# Altium schematic sheet fdc.SchDoc
size A4
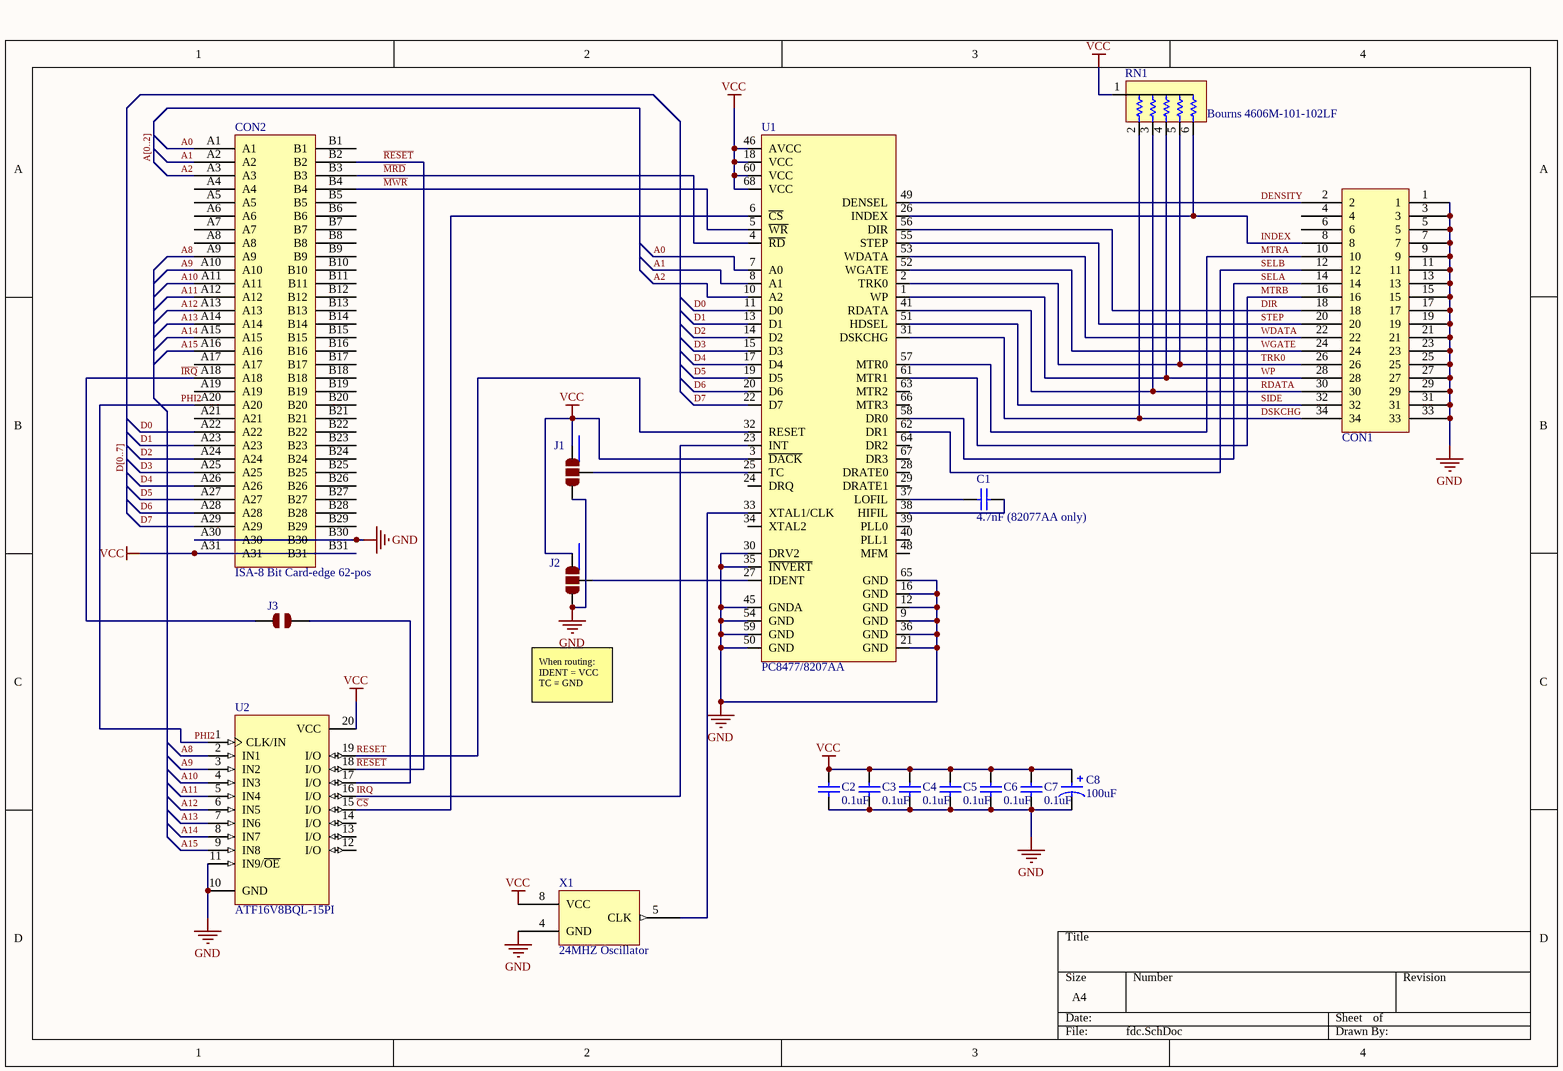
[diagram p0: fdc.SchDoc]

## Parts
C1  4.7nF (82077AA only)  [PCB-d10phdktxl02f6vu32bf-1]
C2  0.1uF  [PCB-gb6o2snpw67z713rrl5r-1]
C3  0.1uF  [PCB-gb6o2snpw67z713rrl5r-1]
C4  0.1uF  [PCB-gb6o2snpw67z713rrl5r-1]
C5  0.1uF  [PCB-gb6o2snpw67z713rrl5r-1]
C6  0.1uF  [PCB-gb6o2snpw67z713rrl5r-1]
C7  0.1uF  [PCB-gb6o2snpw67z713rrl5r-1]
C8  100uF  [PCB-zkzjfh55ek2i5yq9ppya-1]
CON1  3M N2524-6002RB  [PCB-na3hxtpjg5diai2m4atz-1]  (value not drawn)
CON2  ISA-8 Bit Card-edge 62-pos  [PCB-2hkdxqdttofatkmr091c-1]
J1  Solder Jumper 2-way  [PCB-rrnqmtokqinrd1vbp5jt-1]  (value not drawn)
J2  Solder Jumper 2-way  [PCB-rrnqmtokqinrd1vbp5jt-1]  (value not drawn)
J3  SMD Jumper  [PCB-20wha1m7m1debrypqlyx-1]  (value not drawn)
RN1  Bourns 4606M-101-102LF  [PCB-6jrb1pmtltsfpt43k1o6-1]
U1  PC8477/8207AA  [PCB-89xdsse3ufb116eei8ku-1]
U2  ATF16V8BQL-15PI  [20P3]
X1  24MHZ Oscillator  [PCB-38wfzuzk5mkmrw5gxtuy-1]

## Nets
GND: C2.1 C3.1 C4.1 C5.1 C6.1 C7.1 C8.2 CON1.1 CON1.3 CON1.5 CON1.7 CON1.9 CON1.11 CON1.13 CON1.15 CON1.17 CON1.19 CON1.21 CON1.23 CON1.25 CON1.27 CON1.29 CON1.31 CON1.33 CON2.A30 CON2.B30 J1.3 J2.3 U1.9(GND) U1.12(GND) U1.16(GND) U1.21(GND) U1.30(DRV2) U1.35(~{INVERT}) U1.36(GND) U1.45(GNDA) U1.50(GND) U1.54(GND) U1.59(GND) U1.65(GND) U2.10(GND) U2.11(IN9/~{OE}) X1.4(GND)
VCC: C2.2 C3.2 C4.2 C5.2 C6.2 C7.2 C8.1 CON2.A31 CON2.B31 J1.1 J2.1 RN1.1 U1.3(~{DACK}) U1.18(VCC) U1.46(AVCC) U1.60(VCC) U1.68(VCC) U2.20(VCC) X1.8(VCC)
A0: CON2.A1 U1.7(A0)
A1: CON2.A2 U1.8(A1)
A2: CON2.A3 U1.10(A2)
A8: CON2.A9 U2.2(IN1)
A9: CON2.A10 U2.3(IN2)
A10: CON2.A11 U2.4(IN3)
A11: CON2.A12 U2.5(IN4)
A12: CON2.A13 U2.6(IN5)
A13: CON2.A14 U2.7(IN6)
A14: CON2.A15 U2.8(IN7)
A15: CON2.A16 U2.9(IN8)
~{CS}: U1.6(~{CS}) U2.15(I/O)
D0: CON2.A22 U1.11(D0)
D1: CON2.A23 U1.13(D1)
D2: CON2.A24 U1.14(D2)
D3: CON2.A25 U1.15(D3)
D4: CON2.A26 U1.17(D4)
D5: CON2.A27 U1.19(D5)
D6: CON2.A28 U1.20(D6)
D7: CON2.A29 U1.22(D7)
DENSITY: CON1.2 U1.49(DENSEL)
DIR: CON1.18 U1.56(DIR)
DSKCHG: CON1.34 RN1.2 U1.31(DSKCHG)
~{IRQ}: CON2.A18 J3.1
INDEX: CON1.8 RN1.6 U1.26(INDEX)
IRQ: U1.23(INT) U2.16(I/O)
~{MRD}: CON2.B3 U1.4(~{RD})
~{MWR}: CON2.B4 U1.5(~{WR})
MTRA: CON1.10 U1.57(MTR0)
MTRB: CON1.16 U1.61(MTR1)
PHI2: CON2.A20 U2.1(CLK/IN)
~{RESET}: CON2.B2 U2.18(I/O)
RDATA: CON1.30 RN1.3 U1.41(RDATA)
RESET: U1.32(RESET) U2.19(I/O)
SELA: CON1.14 U1.58(DR0)
SELB: CON1.12 U1.62(DR1)
SIDE: CON1.32 U1.51(HDSEL)
STEP: CON1.20 U1.55(STEP)
TRK0: CON1.26 RN1.5 U1.2(TRK0)
WDATA: CON1.22 U1.53(WDATA)
WGATE: CON1.24 U1.52(WGATE)
WP: CON1.28 RN1.4 U1.1(WP)
NetC1_1: C1.1 U1.37(LOFIL)
NetC1_2: C1.2 U1.38(HIFIL)
NetJ1_2: J1.2 U1.25(TC)
NetJ2_2: J2.2 U1.27(IDENT)
NetJ3_2: J3.2 U2.17(I/O)
NetU1_33: U1.33(XTAL1/CLK) X1.5(CLK)

Not connected (* = marked no-connect by the designer): CON1 4 6; CON2 A4 A5 A6 A7 A8 A17 A19 A21 B1 B5 B6 B7 B8 B9 B10 B11 B12 B13 B14 B15 B16 B17 B18 B19 B20 B21 B22 B23 B24 B25 B26 B27 B28 B29; U1 24(DRQ) 28(DRATE0) 29(DRATE1) 34(XTAL2) 39(PLL0) 40(PLL1) 42(NC) 43(NC) 44(NC) 47(NC) 48(MFM) 63(MTR2) 64(DR2) 66(MTR3) 67(DR3); U2 12(I/O) 13(I/O) 14(I/O)

## Buses and harness runs
bus A[0..2]
bus D[0..7]

## Notes on the sheet
- When routing:
  IDENT = VCC
  TC = GND

## Library data of the parts
C1 = CMP-124134-6: K Series 4.7 nF 50 V ±10 % Tolerance X7R Radial Multilayer Ceramic Capacitor; Operating Temperature: 125 °C (max); Number of Pins: 2; Size-Height: 4.00 mm; Size-Thickness: 2.60 mm; OctopartID: 56a79df725318960; Size-Diameter: 500 µm
C2-C7 = CMP-mck1uwszlh1jwp1a4juu-2: Generic Ceramic capacitor; CustomComponentID: mck1uwszlh1jwp1a4juu
C8 = CMP-2ourdj6tgxzh24x23r42-1: Electrolytic capacitor, 2.5mm lead spacing; CustomComponentID: 2ourdj6tgxzh24x23r42
CON1 = CMP-77a2bea8dfe9a865-2: Header, 4-Wall; Copper Alloy; 200 u in.60/40 Tin/Lead; 2; Black; 0.38 in.; 34; Insulation Resistance: 1.00 GΩ; Lead-Free Status: Lead Free; Voltage Rating (AC): 350 V; Number of Mating Cycles: 200; Pin Pitch: 2.54 mm; Number of Positions: 34; RoHS: Compliant; Size-Width: 8.59 mm; REACH SVHC Compliance: No SVHC; Mounting Style: Through Hole, Vertical; Size-Length: 50.5 mm; Flammability Rating: UL 94 V-0; Orientation: Straight; Size-Height: 9.65 mm; Contact Plating: Tin, Gold; Packaging: Tube
CON2 = CMP-azy0yq1pw9sh8verv59u-4: Card-Edge Male, 62 pos
J1 J2 = CMP-0rfjo47dqw9gp5mzow1m-3: SMD Jumper; CustomComponentID: 0rfjo47dqw9gp5mzow1m
J3 = CMP-tvx73bcnyo619itupziq-4
RN1 = CMP-dbf412e711c10433-1: Res Thick Film NET 1K Ohm 2% 9/10W ±100ppm/°C BUS Conformal 6-Pin SIP Pin Thru-Hole Bulk; Resistance: 1.00 k?; Octopart URL: https://octopart.com/4606m-101-102lf-bourns-1699667; Manufacturer Part Number: 4606M-101-102LF; Mounting Style: Through Hole; Packaging: Bulk; Number of Pins: 6; Resistance Tolerance: ±2%; RoHS: Compliant; OctopartID: dbf412e711c10433
U1 = CMP-e29e2b93411d3d59-3: IC Advanced Floppy Ctrlr 68PLCC; Lead-Free Status: Contains Lead; OctopartID: e29e2b93411d3d59; Octopart URL: https://octopart.com/pc8477bv-1-national+semiconductor-493285
U2 = CMP-1259920-2: ATF16V8BQL 5.0V Industry Standard SPLD, 20-lead PDIP, Speed Grade 15, Industrial Grade; Access Time: 1.5e-08 s; Clock Speed: 15000000000.0 Hz; Lead-Free Status: Contains Lead; Number of I/O Pins: 20; Case/Package: DIP; Mounting Style: Through Hole; Number of Pins: 20; Octopart Url: https://octopart.com/atf16v8bql-15pi-atmel-494436; OctopartID: eb6f2262456d34a8; Packaging: Tube; RoHS: Non-Compliant; Supply Voltage (DC): 5.0 V; Manufacturer Part Number: ATF16V8BQL-15PI
X1 = CMP-5f5w4rnabuyvhbl8pua9-1: Generic footprint for Dip-8 Can Oscillator; CustomComponentID: 5f5w4rnabuyvhbl8pua9